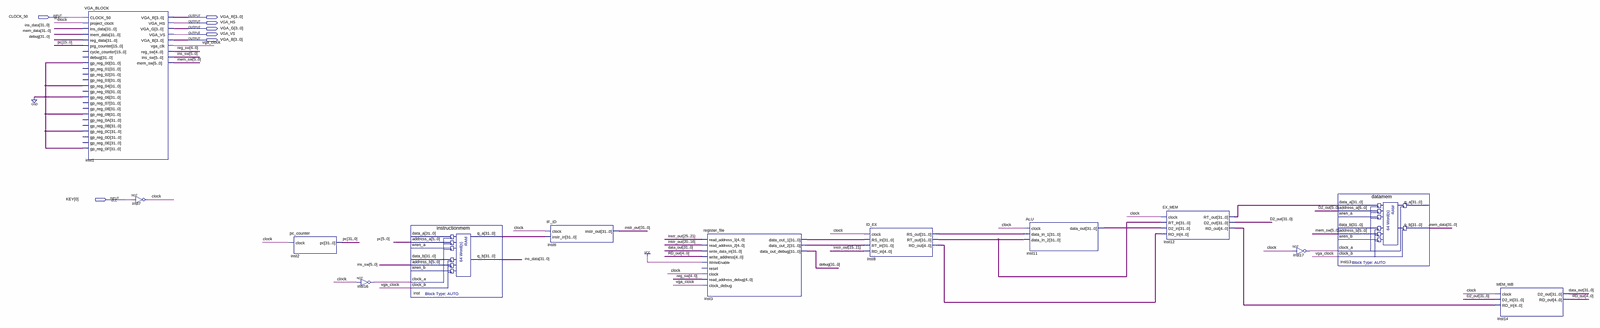
[diagram p0: schematic sheet, whole]
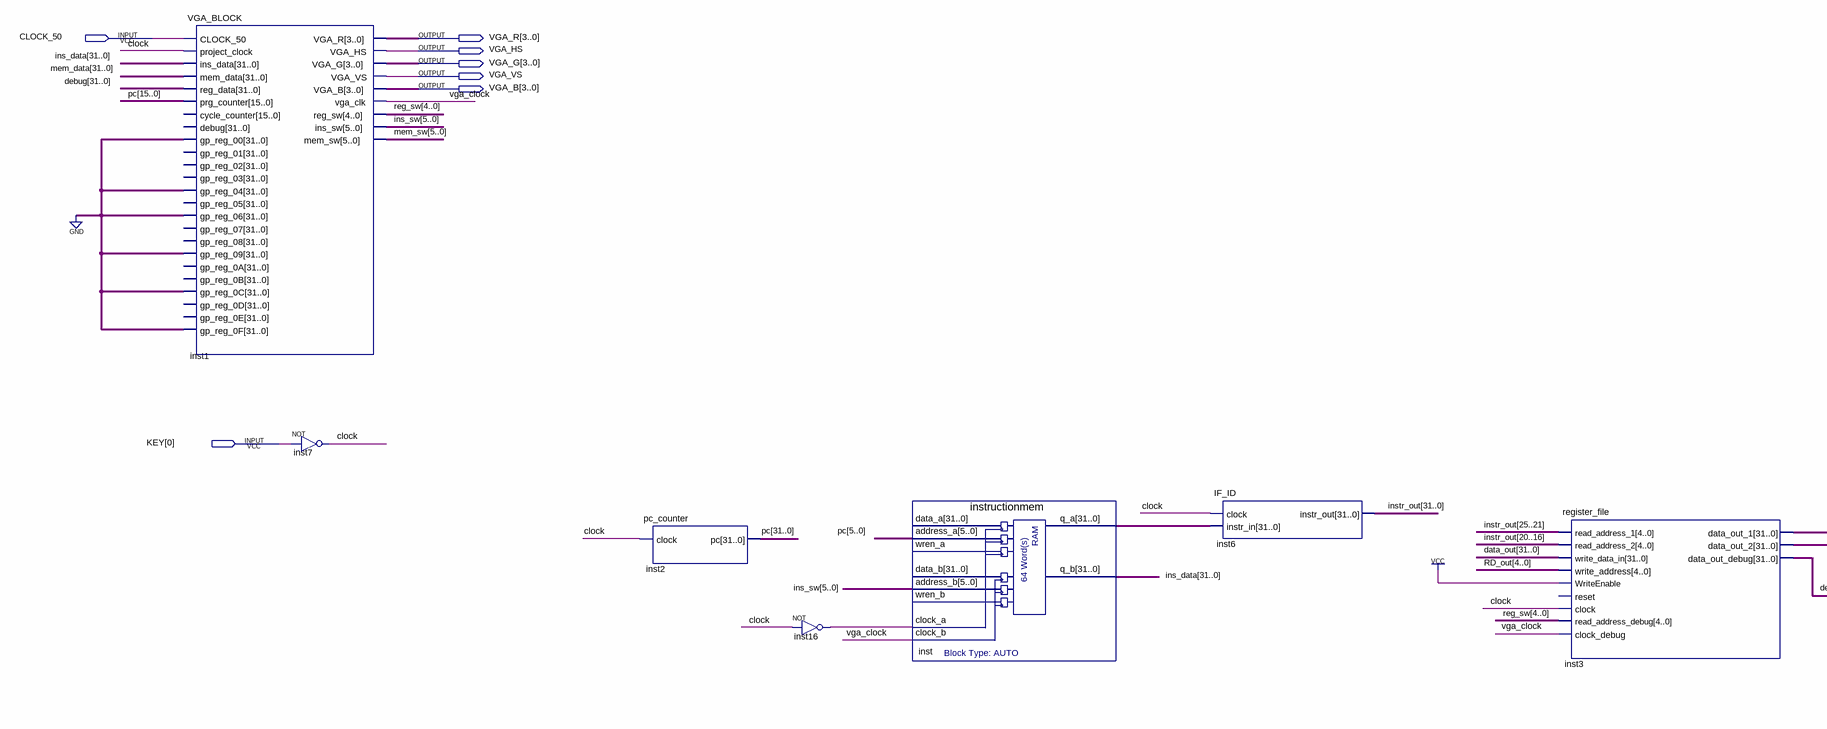
[diagram p1: schematic sheet, left part]
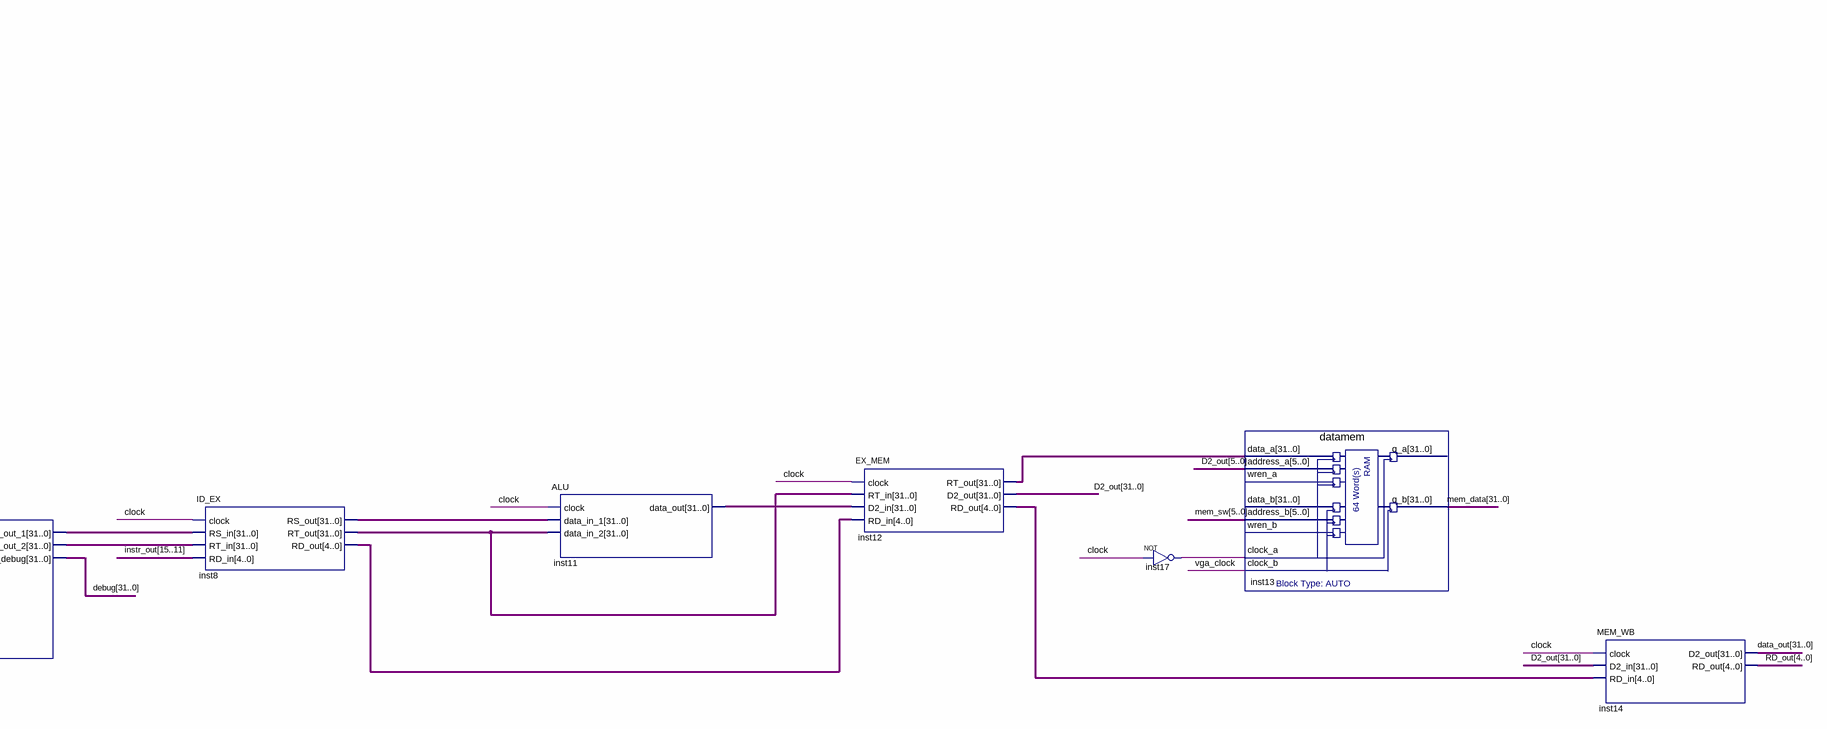
[diagram p2: schematic sheet, right part]
// Quartus schematic project.bdf as structural Verilog: 13 symbols, 7 pins
module project (
  input  CLOCK_50,
  input  [0:0] KEY,
  output [3:0] VGA_R,
  output VGA_HS,
  output [3:0] VGA_G,
  output VGA_VS,
  output [3:0] VGA_B
);

  wire clock, inst16_out, inst17_out, vga_clock;
  wire [4:0] inst8_rd_out, inst12_rd_out, RD_out, reg_sw;
  wire [5:0] ins_sw, mem_sw;
  wire [31:0] D2_out, data_out, debug, ins_data, inst3_data_out_1, inst3_data_out_2, inst8_rs_out,
       inst8_rt_out, inst11_data_out, inst12_rt_out, inst_q_a, instr_out, mem_data, pc;

  VGA_BLOCK inst1 (
    .CLOCK_50(CLOCK_50), .project_clock(clock), .ins_data(ins_data), .mem_data(mem_data), .reg_data(debug),
    .prg_counter(pc[15:0]), .gp_reg_00({32{1'b0}}), .gp_reg_04({32{1'b0}}), .gp_reg_06({32{1'b0}}),
    .gp_reg_09({32{1'b0}}), .gp_reg_0C({32{1'b0}}), .gp_reg_0F({32{1'b0}}), .VGA_R(VGA_R), .VGA_HS(VGA_HS),
    .VGA_G(VGA_G), .VGA_VS(VGA_VS), .VGA_B(VGA_B), .vga_clk(vga_clock), .reg_sw(reg_sw), .ins_sw(ins_sw),
    .mem_sw(mem_sw));  // open: cycle_counter, debug, gp_reg_01, gp_reg_02, gp_reg_03, gp_reg_05, gp_reg_07, gp_reg_08, gp_reg_0A, gp_reg_0B, gp_reg_0D, gp_reg_0E
  not inst7 (clock, KEY[0]);
  pc_counter inst2 (.clock(clock), .pc(pc));
  not inst16 (inst16_out, clock);
  instructionmem inst (
    .address_a(pc[5:0]), .address_b(ins_sw), .clock_a(inst16_out), .clock_b(vga_clock), .q_a(inst_q_a),
    .q_b(ins_data));  // open: data_a, wren_a, data_b, wren_b
  IF_ID inst6 (.clock(clock), .instr_in(inst_q_a), .instr_out(instr_out));
  register_file inst3 (
    .read_address_1(instr_out[25:21]), .read_address_2(instr_out[20:16]), .write_data_in(data_out),
    .write_address(RD_out), .WriteEnable(1'b1), .clock(clock), .read_address_debug(reg_sw),
    .clock_debug(vga_clock), .data_out_1(inst3_data_out_1), .data_out_2(inst3_data_out_2),
    .data_out_debug(debug));  // open: reset
  ID_EX inst8 (
    .clock(clock), .RS_in(inst3_data_out_1), .RT_in(inst3_data_out_2), .RD_in(instr_out[15:11]),
    .RS_out(inst8_rs_out), .RT_out(inst8_rt_out), .RD_out(inst8_rd_out));
  ALU inst11 (.clock(clock), .data_in_1(inst8_rs_out), .data_in_2(inst8_rt_out), .data_out(inst11_data_out));
  EX_MEM inst12 (
    .clock(clock), .RT_in(inst8_rt_out), .D2_in(inst11_data_out), .RD_in(inst8_rd_out),
    .RT_out(inst12_rt_out), .D2_out(D2_out), .RD_out(inst12_rd_out));
  not inst17 (inst17_out, clock);
  datamem inst13 (
    .data_a(inst12_rt_out), .address_a(D2_out[5:0]), .address_b(mem_sw), .clock_a(inst17_out),
    .clock_b(vga_clock), .q_b(mem_data));  // open: wren_a, data_b, wren_b, q_a
  MEM_WB inst14 (.clock(clock), .D2_in(D2_out), .RD_in(inst12_rd_out), .D2_out(data_out), .RD_out(RD_out));
endmodule
